# Altium schematic sheet LDO_int.SchDoc
size 420 x 297 mm; Address1: Address1; Address2: Address2; Address3: Address3; Address4: Address4; SheetNumber: 1; Scale: 1:1; Разраб.: Иванов; Обозначение документа: АБВГ.123456.001 Э3; Пров.: Петров; Утв.: Сидоров; Наименование организации: ОАО "Концерн "МПО-Гидроприбор"; Перв. применение: АБВГ.123456.000; Наименование изделия 1: Плата; Наименование изделия 2: Схема электрическая; Наименование изделия 3: принципиальная; Нач. отд.: Нач. отд.; Фамилия нач. отд.: Сидоров
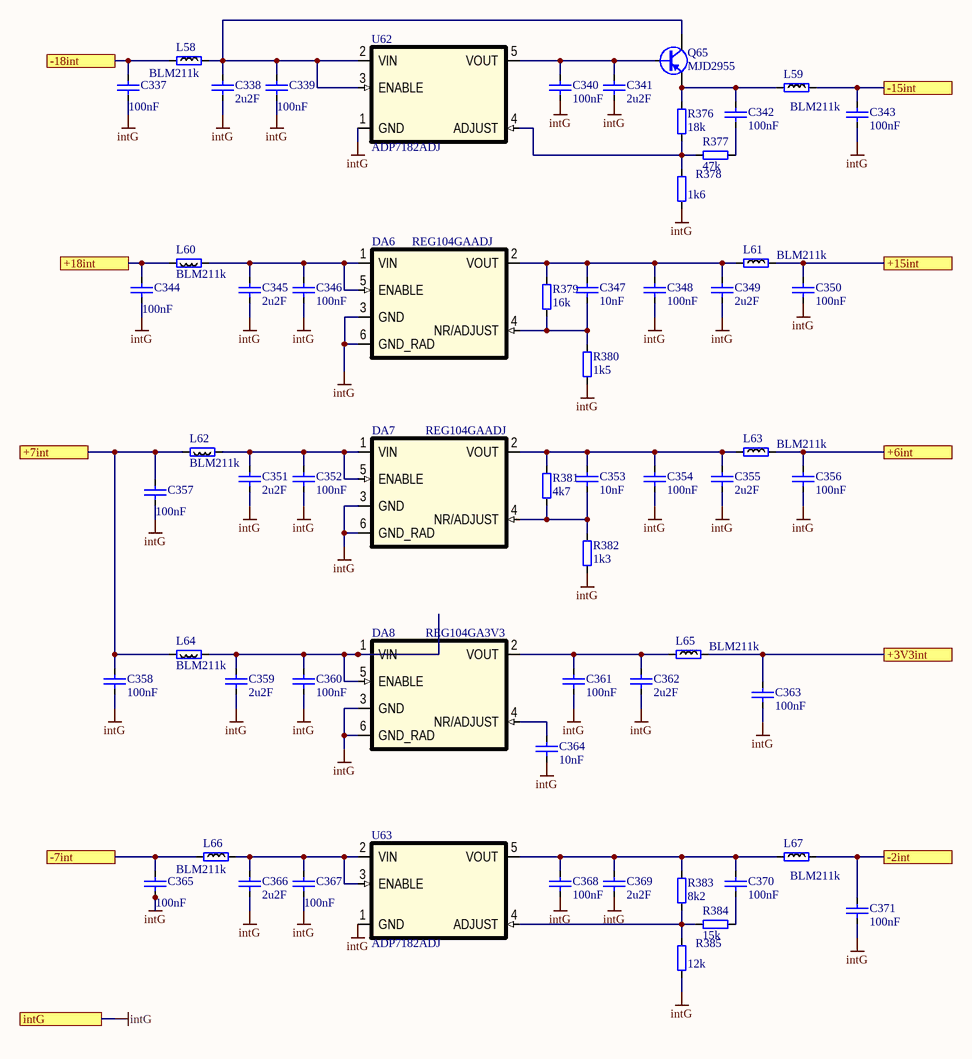
[diagram p0: LDO_int.SchDoc]

## Parts
C337  100nF  [SMD0805CAP]
C338  2u2F  [SMD0805CAP]
C339  100nF  [SMD0805CAP]
C340  100nF  [SMD0805CAP]
C341  2u2F  [SMD0805CAP]
C342  100nF  [SMD0805CAP]
C343  100nF  [SMD0805CAP]
C344  100nF  [SMD0805CAP]
C345  2u2F  [SMD0805CAP]
C346  100nF  [SMD0805CAP]
C347  10nF  [SMD0805CAP]
C348  100nF  [SMD0805CAP]
C349  2u2F  [SMD0805CAP]
C350  100nF  [SMD0805CAP]
C351  2u2F  [SMD0805CAP]
C352  100nF  [SMD0805CAP]
C353  10nF  [SMD0805CAP]
C354  100nF  [SMD0805CAP]
C355  2u2F  [SMD0805CAP]
C356  100nF  [SMD0805CAP]
C357  100nF  [SMD0805CAP]
C358  100nF  [SMD0805CAP]
C359  2u2F  [SMD0805CAP]
C360  100nF  [SMD0805CAP]
C361  100nF  [SMD0805CAP]
C362  2u2F  [SMD0805CAP]
C363  100nF  [SMD0805CAP]
C364  10nF  [SMD0805CAP]
C365  100nF  [SMD0805CAP]
C366  2u2F  [SMD0805CAP]
C367  100nF  [SMD0805CAP]
C368  100nF  [SMD0805CAP]
C369  2u2F  [SMD0805CAP]
C370  100nF  [SMD0805CAP]
C371  100nF  [SMD0805CAP]
DA6  REG104GAADJ  [SOT223_6-127]
DA7  REG104GAADJ  [SOT223_6-127]
DA8  REG104GA3V3  [SOT223_6-127]
L58  BLM211k  [RESC2012X50N]
L59  BLM211k  [RESC2012X50N]
L60  BLM211k  [RESC2012X50N]
L61  BLM211k  [RESC2012X50N]
L62  BLM211k  [RESC2012X50N]
L63  BLM211k  [RESC2012X50N]
L64  BLM211k  [RESC2012X50N]
L65  BLM211k  [RESC2012X50N]
L66  BLM211k  [RESC2012X50N]
L67  BLM211k  [RESC2012X50N]
Q65  MJD2955  [DPAK]
R376  18k  [SMD0805RES]
R377  47k  [SMD0805RES]
R378  1k6  [SMD0805RES]
R379  16k  [SMD0805RES]
R380  1k5  [SMD0805RES]
R381  4k7  [SMD0805RES]
R382  1k3  [SMD0805RES]
R383  8k2  [SMD0805RES]
R384  15k  [SMD0805RES]
R385  12k  [SMD0805RES]
U62  ADP7182ADJ  [SOT23-5]
U63  ADP7182ADJ  [SOT23-5]

## Ports
+3V3int, +6int, +7int, +15int, +18int, -2int, -7int, -15int, -18int, intG

## Nets
intG: C337.2 C338.2 C339.2 C340.1 C341.1 C343.1 C344.2 C345.1 C346.1 C348.1 C349.1 C350.1 C351.1 C352.1 C354.1 C355.1 C356.1 C357.2 C358.1 C359.1 C360.1 C361.1 C362.1 C363.1 C364.1 C365.2 C366.2 C367.2 C368.1 C369.1 C371.1 DA6.3(GND) DA6.6(GND_RAD) DA7.3(GND) DA7.6(GND_RAD) DA8.3(GND) DA8.6(GND_RAD) R378.1 R380.1 R382.1 R385.1 U62.1(GND) U63.1(GND) ; port intG
+3V3int: C363.2 L65.1 ; port +3V3int
+6int: C356.2 L63.1 ; port +6int
+7int: C357.1 C358.2 L62.1 L64.1 ; port +7int
+15int: C350.2 L61.1 ; port +15int
+18int: C344.1 L60.1 ; port +18int
-2int: C371.2 L67.1 ; port -2int
-7int: C365.1 L66.2 ; port -7int
-15int: C343.2 L59.1 ; port -15int
-18int: C337.1 L58.2 ; port -18int
NetC338_1: C338.1 C339.1 L58.1 Q65.3(C) U62.2(VIN) U62.3(ENABLE)
NetC340_2: C340.2 C341.2 Q65.1(B) U62.5(VOUT)
NetC342_1: C342.1 R377.1
NetC342_2: C342.2 L59.2 Q65.2(E) R376.2
NetC345_2: C345.2 C346.2 DA6.1(VIN) DA6.5(ENABLE) L60.2
NetC347_1: C347.1 DA6.4(NR/ADJUST) R379.1 R380.2
NetC347_2: C347.2 C348.2 C349.2 DA6.2(VOUT) L61.2 R379.2
NetC351_2: C351.2 C352.2 DA7.1(VIN) DA7.5(ENABLE) L62.2
NetC353_1: C353.1 DA7.4(NR/ADJUST) R381.1 R382.2
NetC353_2: C353.2 C354.2 C355.2 DA7.2(VOUT) L63.2 R381.2
NetC359_2: C359.2 C360.2 DA8.1(VIN) DA8.5(ENABLE) L64.2
NetC361_2: C361.2 C362.2 DA8.2(VOUT) L65.2
NetC364_2: C364.2 DA8.4(NR/ADJUST)
NetC366_1: C366.1 C367.1 L66.1 U63.2(VIN) U63.3(ENABLE)
NetC368_2: C368.2 C369.2 C370.2 L67.2 R383.2 U63.5(VOUT)
NetC370_1: C370.1 R384.1
NetR376_1: R376.1 R377.2 R378.2 U62.4(ADJUST)
NetR383_1: R383.1 R384.2 R385.2 U63.4(ADJUST)

## Notes on the sheet
- Подп. и дата
- Инв. № дубл.
- Взам. инв. №
- Инв. № подл.
- Изм.
- Лист
- № докум.
- Подп.
- Дата
- Копировал
- Формат А3

## Library data of the parts
C337-C371 = C0805: Чип конденсатор 0805; Voltage: 25V; Vendor: Vishay; DielectricType: X5R; SMD Solders: 2; Solder Option: RM; Tolerance: 20%; Pkg: SMD0805; Device: Cap0805; Price: 2
  C337 C339 C340 C342-C344 C346 C348 C350 C352 C354 C356-C358 C360 C361 C363 C365 C367 C368 C370 C371: Value: 100nF
  C338 C341 C345 C349 C351 C355 C359 C362 C366 C369: Value: 2u2F
  C347 C353 C364: Value: 10nF
DA6 DA7 = REG104GA: Positive LDO Linear stabilizer; Vendor: Texas Instruments; Value: ADJ; SMD Solders: 6; Solder Option: RM; TC: 70ppm/C; Tolerance: +-2% Max; Pkg: SOT223-6; Name to order: REG104GA-A; Vref: 1V295; Price: 1000; Device: REG104GA
DA8 = REG104GA: Positive LDO Linear stabilizer; Vendor: Texas Instruments; Value: 3V3; SMD Solders: 6; Solder Option: RM; TC: 70ppm/C; Tolerance: +-2% Max; Pkg: SOT223-6; Name to order: REG104GA-3.3; Vref: 1V295; Price: 1000; Device: REG104GA
L58 L60 L62 L64 L66 = BLM21: SMD Ferrite bead 0805; Vendor: Vishay; Value: 1k; Pkg: SMD0805; SMD Solders: 2; Solder Option: RM; Price: 10; Device: BLM21
L59 L61 L63 L65 L67 = BLM21: SMD Ferrite bead 0805; Vendor: Vishay; Value: 1k; Pkg: SMD0805; SMD Solders: 2; Solder Option: i; Price: 10; Device: BLM21
Q65 = MJD2955: PNP транзистор; Vendor: ON Semiconductor; SMD Solders: 3; Solder Option: RM; Name to order: MJD29G55; Voltage: -60V; Pkg: DPAK; Price: 100; Device: MJD2955
R376 R379 R381 R383 = R0805: Чип резистор 0805; Vendor: Vishay; SMD Solders: 2; Solder Option: RM; TC: 100ppm/C; Tolerance: 1%; Pkg: SMD0805; Pwr: 125mW; Device: Res0805; Price: 2
  R376: Value: 18k
  R379: Value: 16k
  R381: Value: 4k7
  R383: Value: 8k2
R377 R378 R380 R382 R384 R385 = R0805: Чип резистор 0805; Vendor: Vishay; SMD Solders: 2; Solder Option: ADJ; TC: 100ppm/C; Tolerance: 1%; Pkg: SMD0805; Pwr: 125mW; Device: Res0805; Price: 2
  R377: Value: 47k
  R378: Value: 1k6
  R380: Value: 1k5
  R382: Value: 1k3
  R384: Value: 15k
  R385: Value: 12k
U62 U63 = ADP7182: Negative LDO Linear stabilizer; Vendor: Analog Devoces; Value: ADJ; SMD Solders: 5; Solder Option: RM; Name to order: ADP7182AUJZ-R7; Vref: 1V22; Pkg: SOT23-5; Price: 100; Device: ADP7182